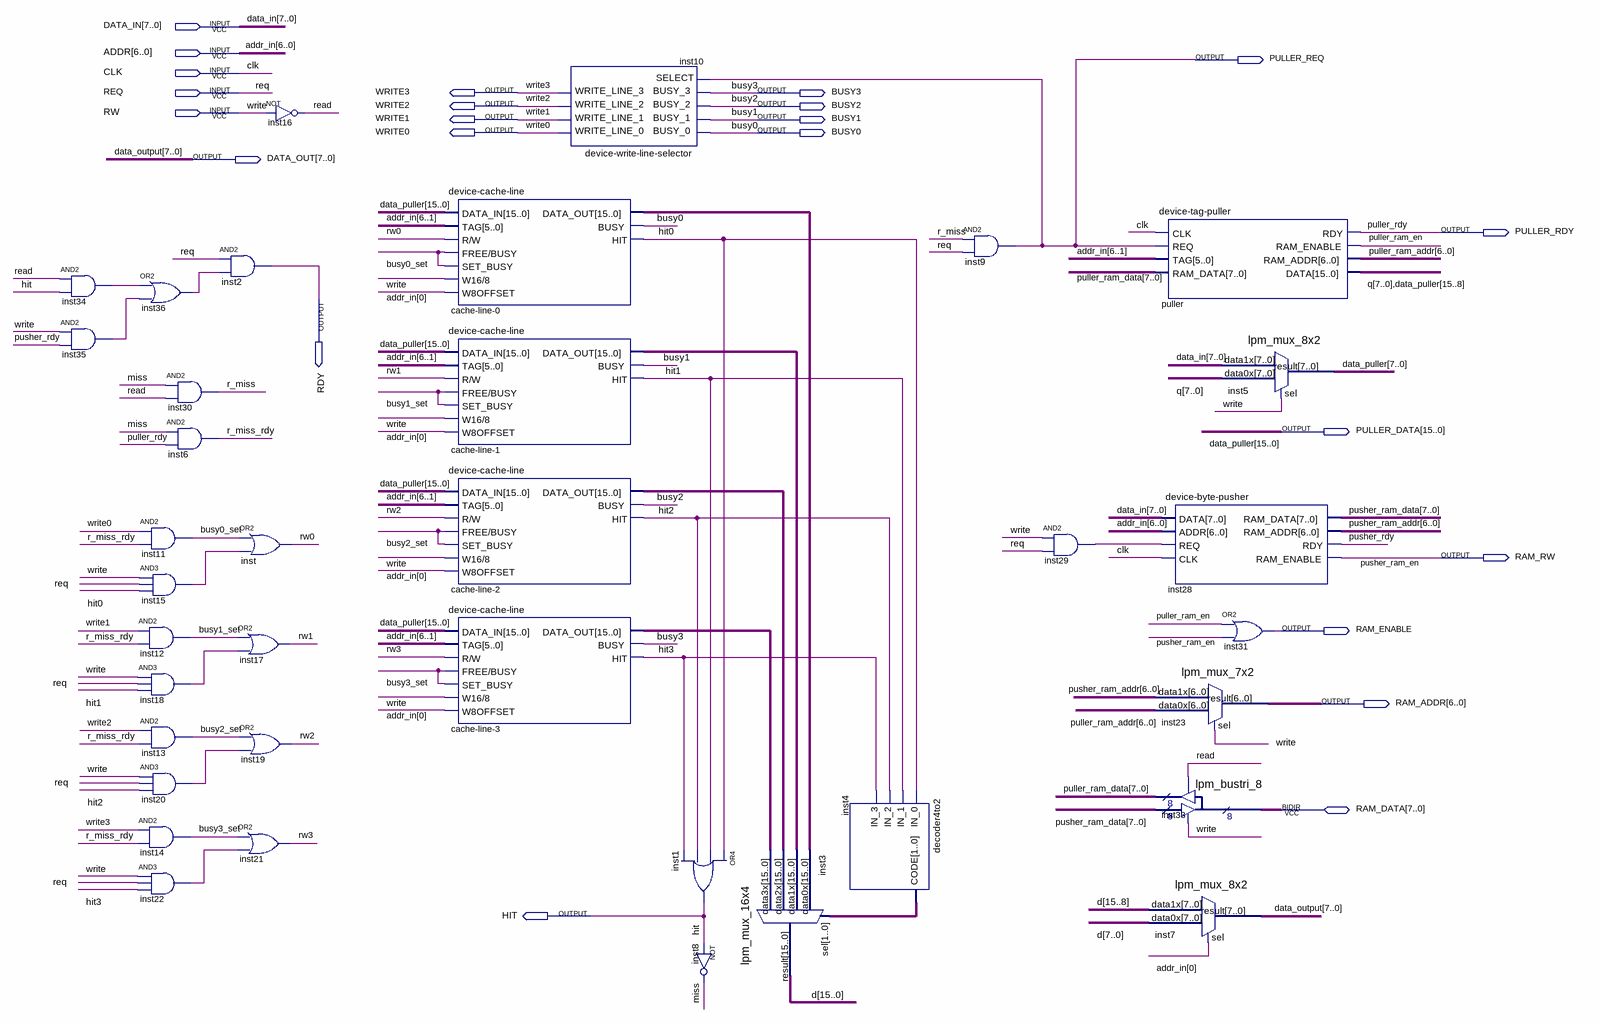
[diagram p0: schematic sheet]
// Quartus schematic device-cache.bdf as structural Verilog: 37 symbols, 23 pins
module \device-cache  (
  input  [7:0] DATA_IN,
  input  [6:0] ADDR,
  input  CLK,
  input  REQ,
  input  RW,
  inout  [7:0] RAM_DATA,
  output PULLER_REQ,
  output WRITE3,
  output BUSY3,
  output WRITE2,
  output BUSY2,
  output WRITE1,
  output BUSY1,
  output WRITE0,
  output BUSY0,
  output [7:0] DATA_OUT,
  output PULLER_RDY,
  output RDY,
  output [15:0] PULLER_DATA,
  output RAM_RW,
  output RAM_ENABLE,
  output [6:0] RAM_ADDR,
  output HIT
);

  wire busy0_set, busy1_set, busy2_set, busy3_set, hit0, hit1, hit2, hit3, inst15_out, inst18_out,
       inst20_out, inst22_out, inst29_out, inst34_out, inst35_out, inst36_out, miss, puller_ram_en,
       pusher_rdy, r_miss, r_miss_rdy, read, rw0, rw1, rw2, rw3;
  wire [1:0] inst4_code;
  wire [6:0] puller_ram_addr, pusher_ram_addr;
  wire [7:0] puller_ram_data, pusher_ram_data, q;
  wire [15:0] cache_line_0_data_out, cache_line_1_data_out, cache_line_2_data_out, cache_line_3_data_out, d;

  and inst34 (inst34_out, read, HIT);
  and inst35 (inst35_out, RW, pusher_rdy);
  or inst36 (inst36_out, inst34_out, inst35_out);
  and inst30 (r_miss, miss, read);
  and inst6 (r_miss_rdy, miss, PULLER_RDY);
  and inst11 (busy0_set, WRITE0, r_miss_rdy);
  and inst15 (inst15_out, RW, REQ, hit0);
  and inst12 (busy1_set, WRITE1, r_miss_rdy);
  and inst18 (inst18_out, RW, REQ, hit1);
  and inst13 (busy2_set, WRITE2, r_miss_rdy);
  and inst20 (inst20_out, RW, REQ, hit2);
  and inst14 (busy3_set, WRITE3, r_miss_rdy);
  and inst22 (inst22_out, RW, REQ, hit3);
  and inst2 (RDY, REQ, inst36_out);
  not inst16 (read, RW);
  or inst (rw0, busy0_set, inst15_out);
  or inst17 (rw1, busy1_set, inst18_out);
  or inst19 (rw2, busy2_set, inst20_out);
  or inst21 (rw3, busy3_set, inst22_out);
  \device-cache-line  \cache-line-0  (
    .DATA_IN(PULLER_DATA), .TAG(ADDR[6:1]), .\R/W (rw0), .\FREE/BUSY (busy0_set), .SET_BUSY(busy0_set),
    .\W16/8 (RW), .W8OFFSET(ADDR[0]), .DATA_OUT(cache_line_0_data_out), .BUSY(BUSY0), .HIT(hit0));
  \device-cache-line  \cache-line-1  (
    .DATA_IN(PULLER_DATA), .TAG(ADDR[6:1]), .\R/W (rw1), .\FREE/BUSY (busy1_set), .SET_BUSY(busy1_set),
    .\W16/8 (RW), .W8OFFSET(ADDR[0]), .DATA_OUT(cache_line_1_data_out), .BUSY(BUSY1), .HIT(hit1));
  \device-cache-line  \cache-line-2  (
    .DATA_IN(PULLER_DATA), .TAG(ADDR[6:1]), .\R/W (rw2), .\FREE/BUSY (busy2_set), .SET_BUSY(busy2_set),
    .\W16/8 (RW), .W8OFFSET(ADDR[0]), .DATA_OUT(cache_line_2_data_out), .BUSY(BUSY2), .HIT(hit2));
  \device-cache-line  \cache-line-3  (
    .DATA_IN(PULLER_DATA), .TAG(ADDR[6:1]), .\R/W (rw3), .\FREE/BUSY (busy3_set), .SET_BUSY(busy3_set),
    .\W16/8 (RW), .W8OFFSET(ADDR[0]), .DATA_OUT(cache_line_3_data_out), .BUSY(BUSY3), .HIT(hit3));
  \device-write-line-selector  inst10 (
    .BUSY_0(BUSY0), .BUSY_1(BUSY1), .BUSY_2(BUSY2), .BUSY_3(BUSY3), .SELECT(PULLER_REQ),
    .WRITE_LINE_0(WRITE0), .WRITE_LINE_1(WRITE1), .WRITE_LINE_2(WRITE2), .WRITE_LINE_3(WRITE3));
  or inst1 (HIT, hit0, hit1, hit2, hit3);
  not inst8 (miss, HIT);
  lpm_mux_16x4 inst3 (
    .data3x(cache_line_3_data_out), .data2x(cache_line_2_data_out), .data1x(cache_line_1_data_out),
    .data0x(cache_line_0_data_out), .sel(inst4_code), .result(d));
  decoder4to2 inst4 (.IN_0(hit0), .IN_1(hit1), .IN_2(hit2), .IN_3(hit3), .CODE(inst4_code));
  and inst9 (PULLER_REQ, r_miss, REQ);
  and inst29 (inst29_out, RW, REQ);
  \device-tag-puller  puller (
    .CLK(CLK), .REQ(PULLER_REQ), .TAG(ADDR[6:1]), .RAM_DATA(puller_ram_data), .RDY(PULLER_RDY),
    .RAM_ENABLE(puller_ram_en), .RAM_ADDR(puller_ram_addr), .DATA({q, PULLER_DATA[15:8]}));
  \device-byte-pusher  inst28 (
    .DATA(DATA_IN), .ADDR(ADDR), .REQ(inst29_out), .CLK(CLK), .RAM_DATA(pusher_ram_data),
    .RAM_ADDR(pusher_ram_addr), .RDY(pusher_rdy), .RAM_ENABLE(RAM_RW));
  lpm_mux_7x2 inst23 (.data1x(pusher_ram_addr), .data0x(puller_ram_addr), .sel(RW), .result(RAM_ADDR));
  lpm_bustri_8 inst33 (
    .enabledt(RW), .data(pusher_ram_data), .enabletr(read), .result(puller_ram_data), .tridata(RAM_DATA));
  lpm_mux_8x2 inst7 (.data1x(d[15:8]), .data0x(d[7:0]), .sel(ADDR[0]), .result(DATA_OUT));
  lpm_mux_8x2 inst5 (.data1x(DATA_IN), .data0x(q), .sel(RW), .result(PULLER_DATA[7:0]));
  or inst31 (RAM_ENABLE, puller_ram_en, RAM_RW);

  // Other names for the same wires on the sheet: addr_in[6:0] = ADDR; data_output[7:0] = DATA_OUT;
  //   data_puller[15:0] = PULLER_DATA; pusher_ram_en = RAM_RW; write = RW
endmodule
